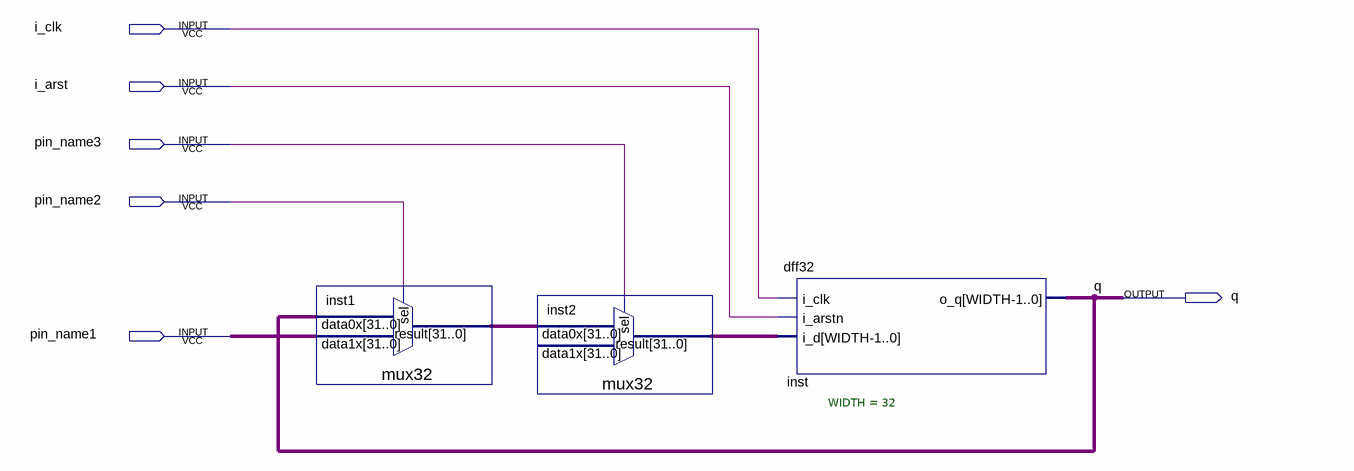
[diagram p0: schematic sheet]
// Quartus schematic laba1.bdf as structural Verilog: 3 symbols, 6 pins
module laba1 (
  input  i_clk,
  input  i_arst,
  input  pin_name3,
  input  pin_name2,
  input  pin_name1,
  output q
);

  wire [31:0] inst1_result, inst2_result, undriven;

  mux32 inst1 (.data1x(undriven), .data0x({32{q}}), .sel(pin_name2), .result(inst1_result));
  mux32 inst2 (.data0x(inst1_result), .sel(pin_name3), .result(inst2_result));  // open: data1x
  dff32 #(.WIDTH(32)) inst (.i_clk(i_clk), .i_arstn(i_arst), .i_d(inst2_result), .o_q(q));
endmodule
